# EAGLE design LIC_rack_OV-03 (EAGLE 7.2.0)
AUTHOR: M. Petrilak; VERSION: 01

## Sheet 1 of 4
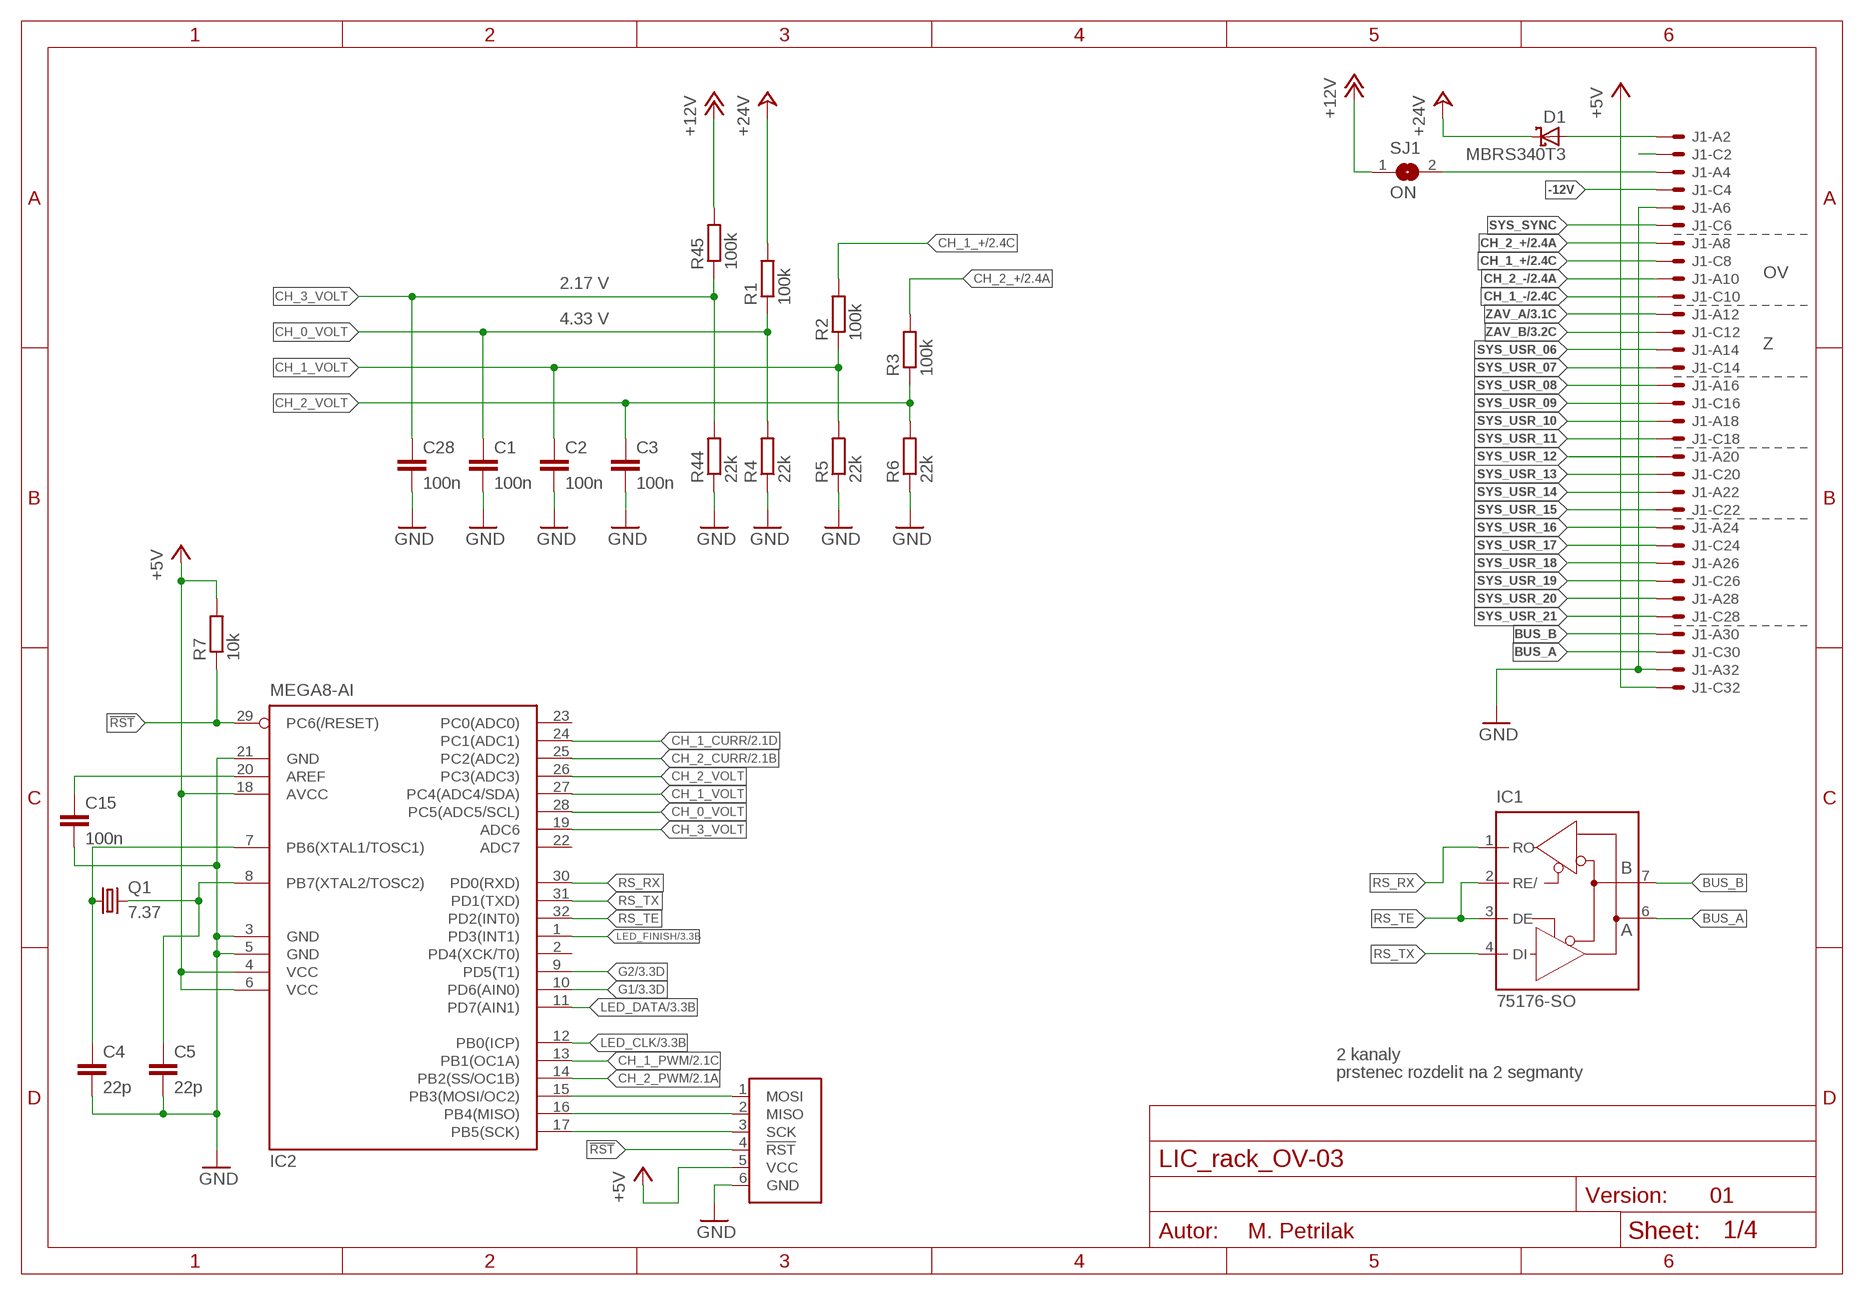
[diagram p0: schematic, sheet 1]

### Parts
C1  100n  C-EUC1206  [C1206]
C2  100n  C-EUC1206  [C1206]
C3  100n  C-EUC1206  [C1206]
C4  22p  C-EUC0805  [C0805]
C5  22p  C-EUC0805  [C0805]
C15  100n  C-EUC1206  [C1206]
C28  100n  C-EUC1206  [C1206]
D1  MBRS340T3  [SMC]
IC1  75176-SO  [SO08]
IC2  MEGA8-AI  [TQFP32-08]
J1  VG32SP  [VG32P]
Q1  7.37  XTAL  [HC49U70]
R1  100k  R-EU_R1206  [R1206]
R2  100k  R-EU_R1206  [R1206]
R3  100k  R-EU_R1206  [R1206]
R4  22k  R-EU_R1206  [R1206]
R5  22k  R-EU_R1206  [R1206]
R6  22k  R-EU_R1206  [R1206]
R7  10k  R-EU_R1206  [R1206]
R44  22k  R-EU_R1206  [R1206]
R45  100k  R-EU_R1206  [R1206]
SJ1  ON  SJ-DEFAULT  [SJ-D]
U1  ATPROG-V  [6410-06]

### Nets
!RST: IC2.29(PC6(/RESET)) R7.1 U1.4(!RST)
+5V: IC2.4(VCC) IC2.6(VCC) IC2.18(AVCC) J1.C32 R7.2 U1.5(VCC) ; also sheet 2,3
+12V: R45.2 SJ1.1 ; also sheet 3
+24V: D1.C R1.2 ; also sheet 2,3
+24V_D: D1.A J1.A2
-12V: J1.C4
AREF: C15.1 IC2.20(AREF)
BUS_A: IC1.6(A) J1.C30
BUS_B: IC1.7(B) J1.A30
CH_0_VOLT: C1.1 IC2.28(PC5(ADC5/SCL)) R1.1 R4.2
CH_1_+: J1.C8 R2.2 ; also sheet 2
CH_1_-: J1.C10 ; also sheet 2
CH_1_CURR: IC2.24(PC1(ADC1)) ; also sheet 2
CH_1_PWM: IC2.13(PB1(OC1A)) ; also sheet 2
CH_1_VOLT: C2.1 IC2.27(PC4(ADC4/SDA)) R2.1 R5.2
CH_2_+: J1.A8 R3.2 ; also sheet 2
CH_2_-: J1.A10 ; also sheet 2
CH_2_CURR: IC2.25(PC2(ADC2)) ; also sheet 2
CH_2_PWM: IC2.14(PB2(SS/OC1B)) ; also sheet 2
CH_2_VOLT: C3.1 IC2.26(PC3(ADC3)) R3.1 R6.2
CH_3_VOLT: C28.1 IC2.19(ADC6) R44.2 R45.1
G1: IC2.10(PD6(AIN0)) ; also sheet 3
G2: IC2.9(PD5(T1)) ; also sheet 3
GND: C1.2 C2.2 C3.2 C4.2 C5.2 C15.2 C28.2 IC2.3(GND) IC2.5(GND) IC2.21(GND) J1.A6 J1.A32 R4.1 R5.1 R6.1 R44.1 U1.6(GND) ; also sheet 2,3
LED_CLK: IC2.12(PB0(ICP)) ; also sheet 3
LED_DATA: IC2.11(PD7(AIN1)) ; also sheet 3
LED_FINISH: IC2.1(PD3(INT1)) ; also sheet 3
PROG_MISO: IC2.16(PB4(MISO)) U1.2(MISO)
PROG_MOSI: IC2.15(PB3(MOSI/OC2)) U1.1(MOSI)
PROG_SCK: IC2.17(PB5(SCK)) U1.3(SCK)
RS_RX: IC1.1(RO) IC2.30(PD0(RXD))
RS_TE: IC1.2(RE/) IC1.3(DE) IC2.32(PD2(INT0))
RS_TX: IC1.4(DI) IC2.31(PD1(TXD))
SYS_12V: J1.A4 SJ1.2
SYS_+5V_NC: J1.C2
SYS_SYNC: J1.C6
SYS_USR_06: J1.A14
SYS_USR_07: J1.C14
SYS_USR_08: J1.A16
SYS_USR_09: J1.C16
SYS_USR_10: J1.A18
SYS_USR_11: J1.C18
SYS_USR_12: J1.A20
SYS_USR_13: J1.C20
SYS_USR_14: J1.A22
SYS_USR_15: J1.C22
SYS_USR_16: J1.A24
SYS_USR_17: J1.C24
SYS_USR_18: J1.A26
SYS_USR_19: J1.C26
SYS_USR_20: J1.A28
SYS_USR_21: J1.C28
XTAL1: C4.1 IC2.7(PB6(XTAL1/TOSC1)) Q1.1
XTAL2: C5.1 IC2.8(PB7(XTAL2/TOSC2)) Q1.2
ZAV_A: J1.A12 ; also sheet 3
ZAV_B: J1.C12 ; also sheet 3
Unconnected: IC2.2(PD4(XCK/T0)) IC2.22(ADC7) IC2.23(PC0(ADC0))

### Notes on the sheet
- OV
- 2.17 V
- 4.33 V
- Z
- 2 kanaly
- prstenec rozdelit na 2 segmanty

## Sheet 2 of 4
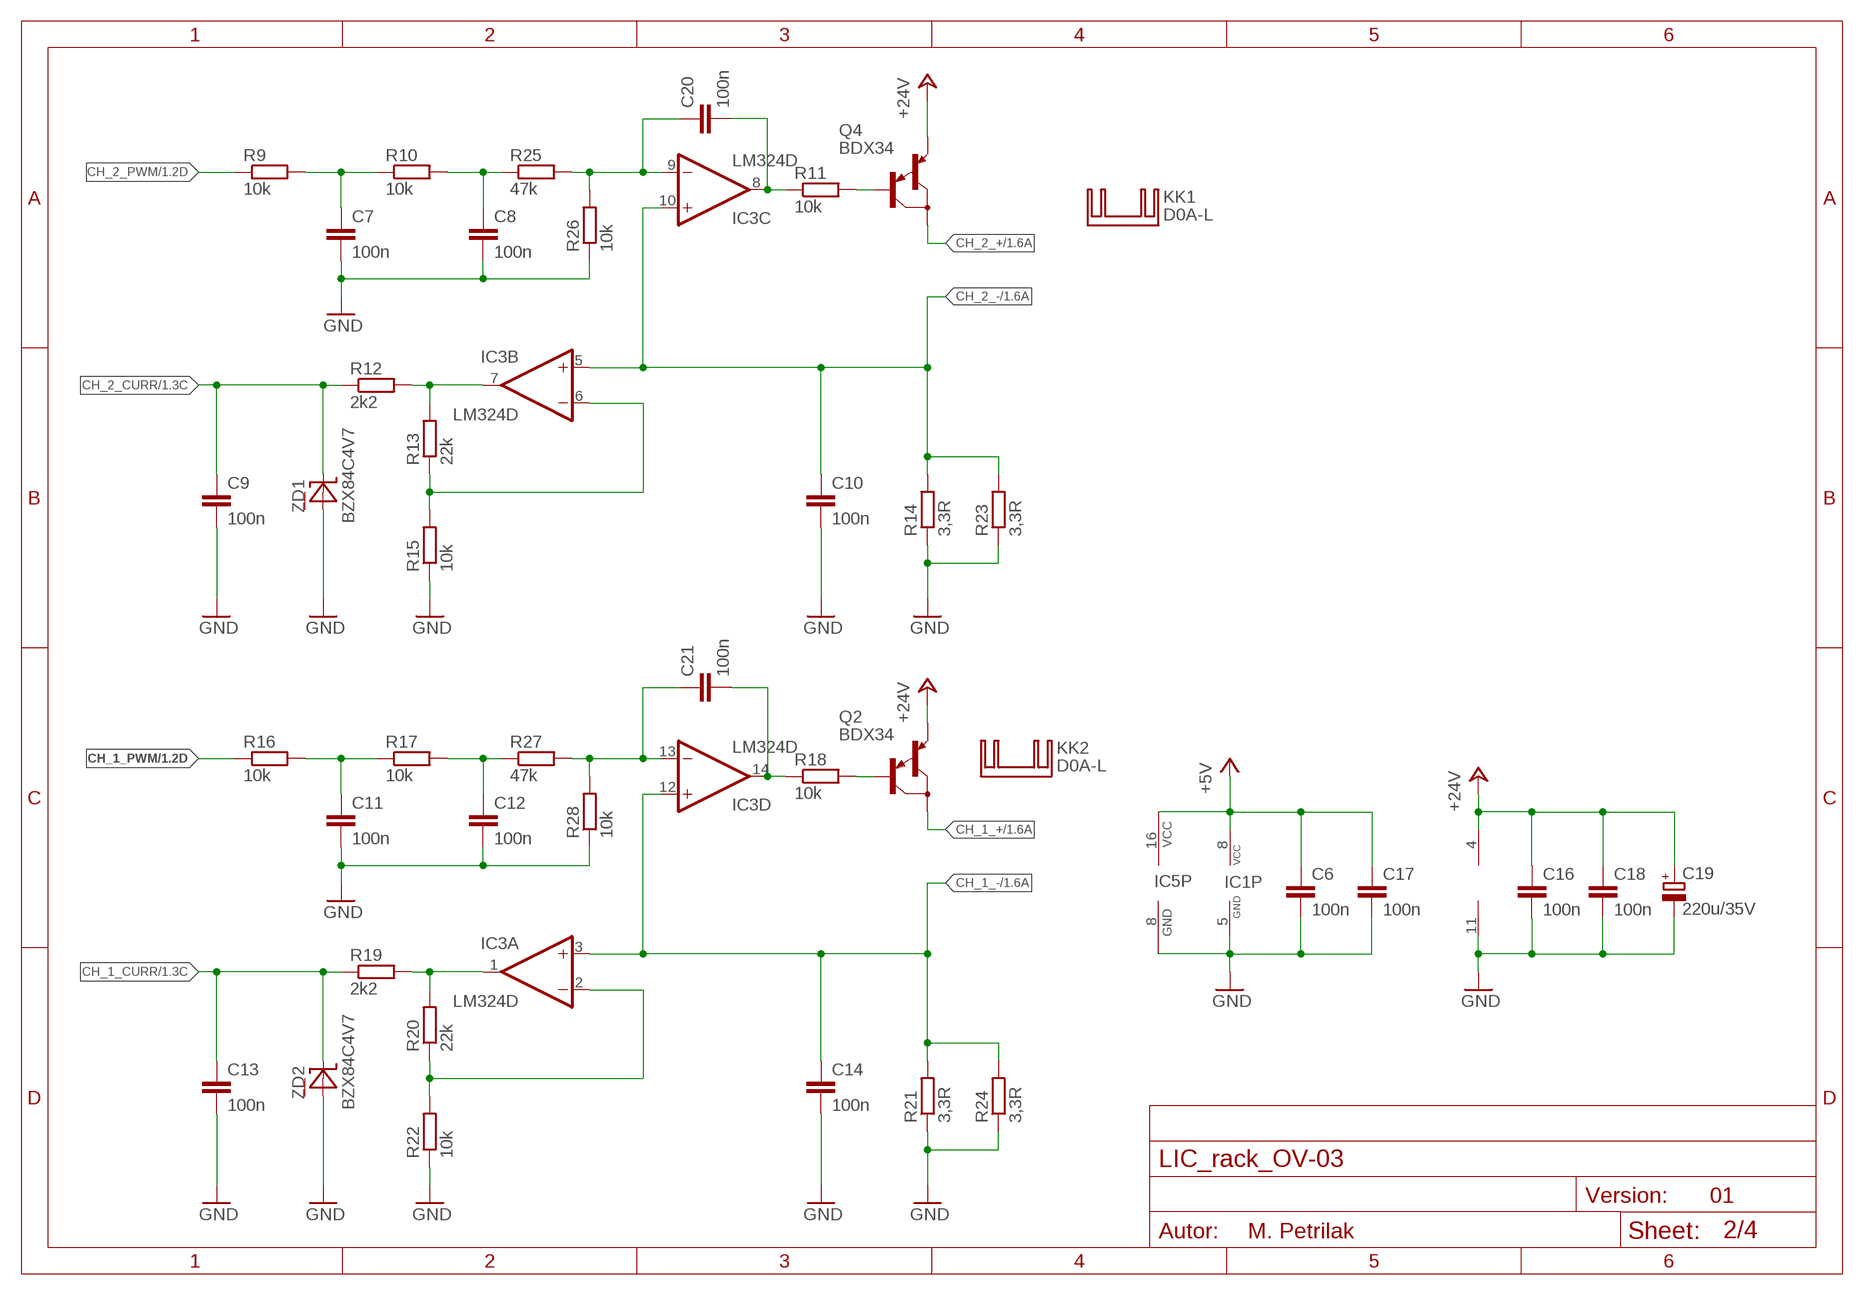
[diagram p1: schematic, sheet 2]

### Parts
C6  100n  C-EUC1206  [C1206]
C7  100n  C-EUC1206  [C1206]
C8  100n  C-EUC1206  [C1206]
C9  100n  C-EUC1206  [C1206]
C10  100n  C-EUC1206  [C1206]
C11  100n  C-EUC1206  [C1206]
C12  100n  C-EUC1206  [C1206]
C13  100n  C-EUC1206  [C1206]
C14  100n  C-EUC1206  [C1206]
C16  100n  C-EUC1206  [C1206]
C17  100n  C-EUC1206  [C1206]
C18  100n  C-EUC1206  [C1206]
C19  220u/35V  CPOL-EUE3.5-8LR  [E3,5-8LR]
C20  100n  C-EUC1206  [C1206]
C21  100n  C-EUC1206  [C1206]
IC3  LM324D  [SO14]
IC5  74LS595D  [SO16]
KK1  D0A-L  [D02A-L]
KK2  D0A-L  [D02A-L]
Q2  BDX34  [TO220]
Q4  BDX34  [TO220]
R9  10k  R-EU_R1206  [R1206]
R10  10k  R-EU_R1206  [R1206]
R11  10k  R-EU_R1206  [R1206]
R12  2k2  R-EU_R1206  [R1206]
R13  22k  R-EU_R1206  [R1206]
R14  3,3R  R-EU_0309/12  [0309/12]
R15  10k  R-EU_R1206  [R1206]
R16  10k  R-EU_R1206  [R1206]
R17  10k  R-EU_R1206  [R1206]
R18  10k  R-EU_R1206  [R1206]
R19  2k2  R-EU_R1206  [R1206]
R20  22k  R-EU_R1206  [R1206]
R21  3,3R  R-EU_0309/12  [0309/12]
R22  10k  R-EU_R1206  [R1206]
R23  3,3R  R-EU_R1206  [R1206]
R24  3,3R  R-EU_R1206  [R1206]
R25  47k  R-EU_R1206  [R1206]
R26  10k  R-EU_R1206  [R1206]
R27  47k  R-EU_R1206  [R1206]
R28  10k  R-EU_R1206  [R1206]
ZD1  BZX84C4V7  [SOT23]
ZD2  BZX84C4V7  [SOT23]

### Nets
+5V: C6.1 C17.1 IC1.8(VCC) IC5.16(VCC) ; also sheet 1,3
+24V: C16.1 C18.1 C19.+ IC3.4(P:V+) Q2.3(E) Q4.3(E) ; also sheet 1,3
CH_1_+: Q2.2(C) ; also sheet 1
CH_1_-: C14.1 IC3.3(A:+IN) IC3.12(D:+IN) R21.2 R24.2 ; also sheet 1
CH_1_BASE: Q2.1(B) R18.2
CH_1_CURR: C13.1 R19.1 ZD2.3(C) ; also sheet 1
CH_1_CURR_HIVOLT: IC3.1(A:OUT) R19.2 R20.2
CH_1_CURR_LOOP: IC3.2(A:-IN) R20.1 R22.2
CH_1_DRIVE: C21.2 IC3.14(D:OUT) R18.1
CH_1_FILT1: C11.1 R16.2 R17.1
CH_1_FILT2: C12.1 R17.2 R27.1
CH_1_FILT3: C21.1 IC3.13(D:-IN) R27.2 R28.2
CH_1_PWM: R16.1 ; also sheet 1
CH_2_+: Q4.2(C) ; also sheet 1
CH_2_-: C10.1 IC3.5(B:+IN) IC3.10(C:+IN) R14.2 R23.2 ; also sheet 1
CH_2_BASE: Q4.1(B) R11.2
CH_2_CURR: C9.1 R12.1 ZD1.3(C) ; also sheet 1
CH_2_CURR_HIVOLT: IC3.7(B:OUT) R12.2 R13.2
CH_2_CURR_LOOP: IC3.6(B:-IN) R13.1 R15.2
CH_2_DRIVE: C20.2 IC3.8(C:OUT) R11.1
CH_2_FILT1: C7.1 R9.2 R10.1
CH_2_FILT2: C8.1 R10.2 R25.1
CH_2_FILT3: C20.1 IC3.9(C:-IN) R25.2 R26.2
CH_2_PWM: R9.1 ; also sheet 1
GND: C6.2 C7.2 C8.2 C9.2 C10.2 C11.2 C12.2 C13.2 C14.2 C16.2 C17.2 C18.2 C19.- IC1.5(GND) IC3.11(P:V-) IC5.8(GND) R14.1 R15.1 R21.1 R22.1 R23.1 R24.1 R26.1 R28.1 ZD1.1(A) ZD2.1(A) ; also sheet 1,3
Unconnected: ZD1.2(NC) ZD2.2(NC)

## Sheet 3 of 4
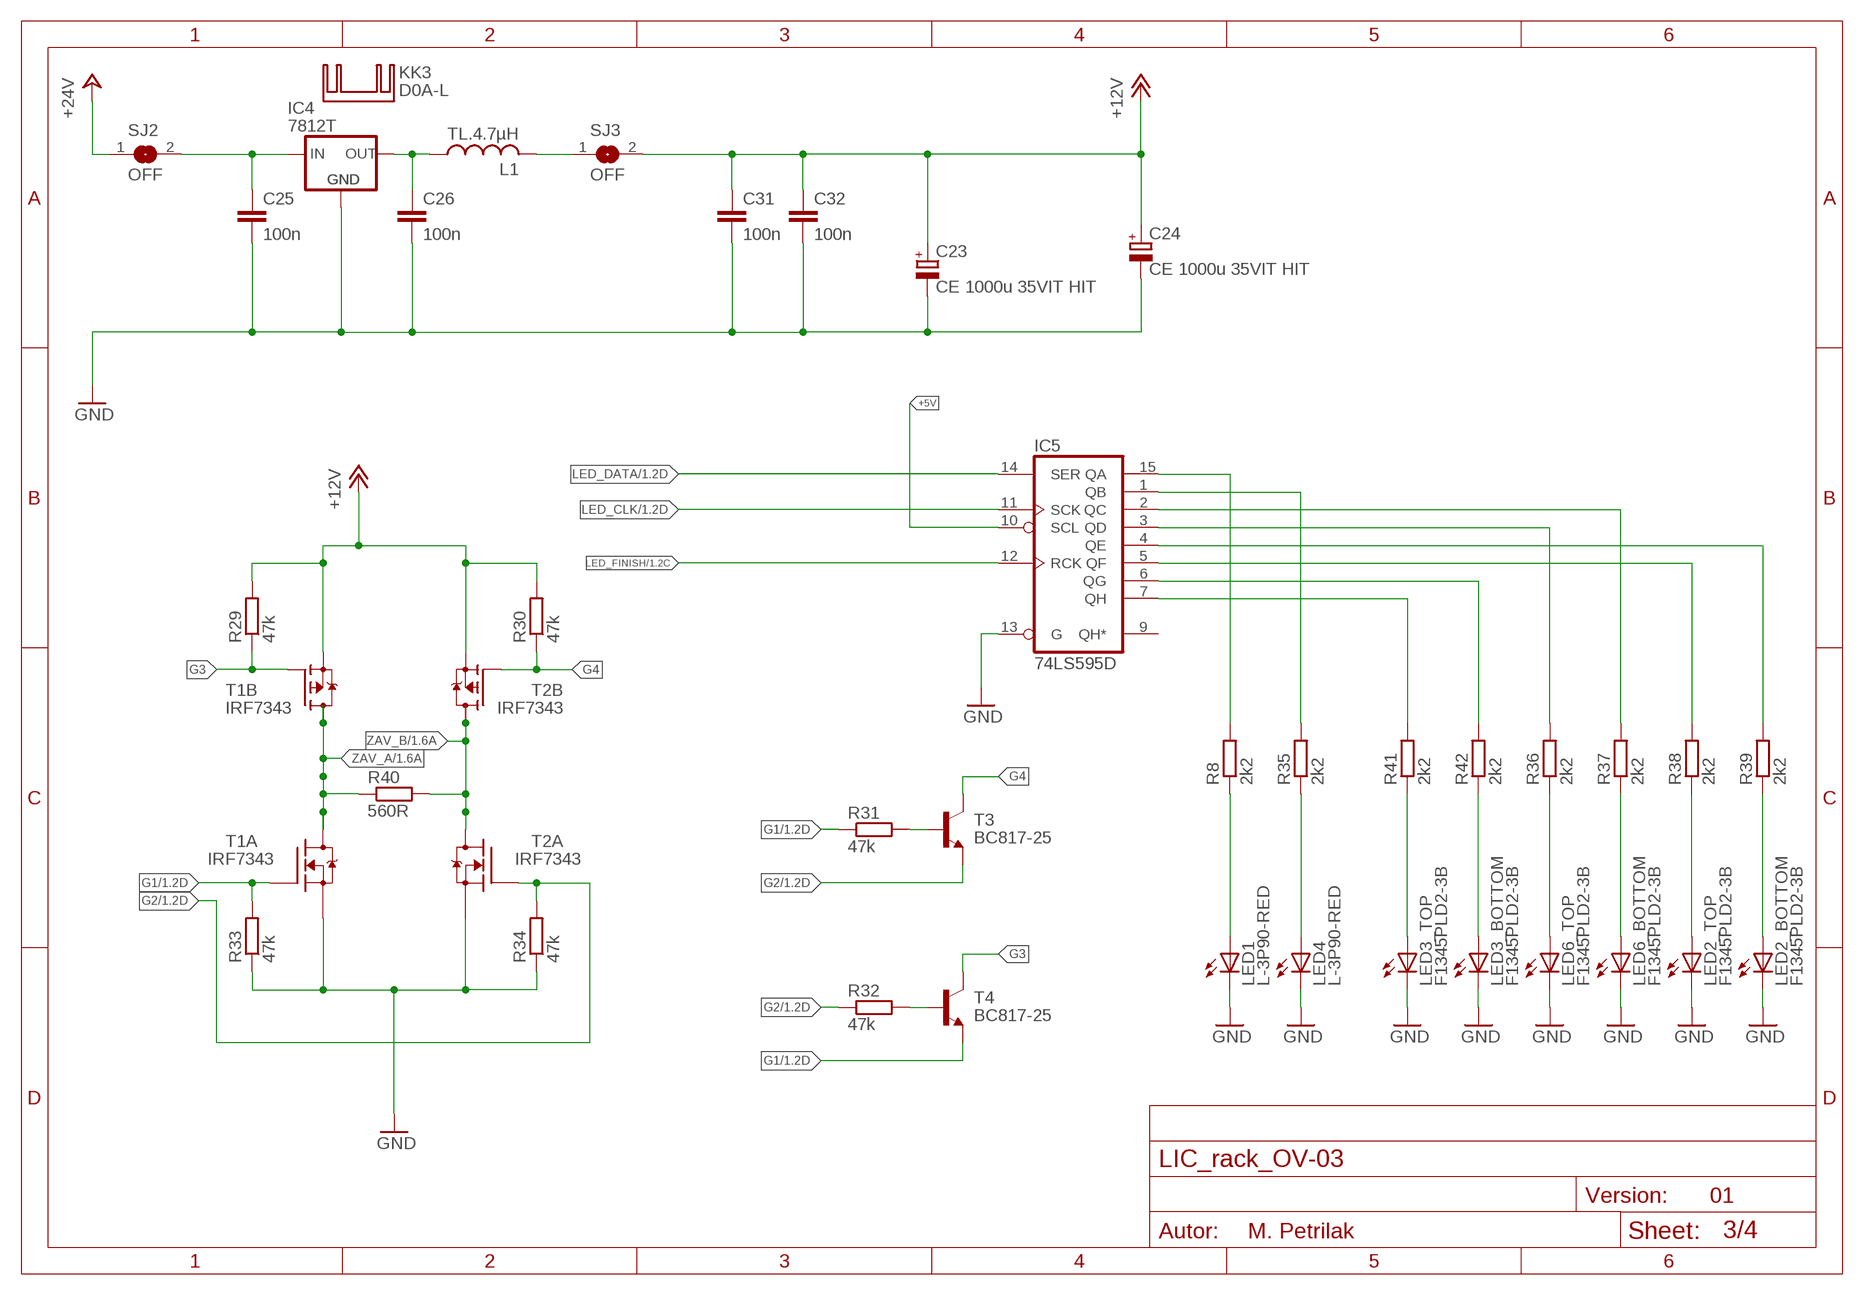
[diagram p2: schematic, sheet 3]

### Parts
C23  CE 1000u 35VIT HIT  CPOL-EUE5-13X26-LR  [E5-13X26-LR]
C24  CE 1000u 35VIT HIT  CPOL-EUE5-13X26-LR  [E5-13X26-LR]
C25  100n  C-EUC1206  [C1206]
C26  100n  C-EUC1206  [C1206]
C31  100n  C-EUC1206  [C1206]
C32  100n  C-EUC1206  [C1206]
IC4  7812T  [TO220H]
KK3  D0A-L  [D02A-L]
L1  TL.4.7µH  L-EU0207/12  [0207/12]
LED1  L-3P90-RED  [L-3P90]
LED2  F1345PLD2-3B  [F1345PLD2-3B]
LED3  F1345PLD2-3B  [F1345PLD2-3B]
LED4  L-3P90-RED  [L-3P90]
LED6  F1345PLD2-3B  [F1345PLD2-3B]
R8  2k2  R-EU_R1206  [R1206]
R29  47k  R-EU_R1206  [R1206]
R30  47k  R-EU_R1206  [R1206]
R31  47k  R-EU_R1206  [R1206]
R32  47k  R-EU_R1206  [R1206]
R33  47k  R-EU_R1206  [R1206]
R34  47k  R-EU_R1206  [R1206]
R35  2k2  R-EU_R1206  [R1206]
R36  2k2  R-EU_R1206  [R1206]
R37  2k2  R-EU_R1206  [R1206]
R38  2k2  R-EU_R1206  [R1206]
R39  2k2  R-EU_R1206  [R1206]
R40  560R  R-EU_R1206  [R1206]
R41  2k2  R-EU_R1206  [R1206]
R42  2k2  R-EU_R1206  [R1206]
SJ2  OFF  SJ  [SJ]
SJ3  OFF  SJ  [SJ]
T1  IRF7343  [SO-8]
T2  IRF7343  [SO-8]
T3  BC817-25  BC817-25-NPN-SOT23-BEC  [SOT23-BEC]
T4  BC817-25  BC817-25-NPN-SOT23-BEC  [SOT23-BEC]

### Nets
12V_FILT: L1.2 SJ3.1
12V_STAB: C26.1 IC4.3(VO) L1.1
12V_STABIN: C25.1 IC4.1(VI) SJ2.2
+5V: IC5.10(SCL) ; also sheet 1,2
+12V: C23.+ C24.+ C31.1 C32.1 R29.2 R30.2 SJ3.2 T1.3(B:S) T2.3(B:S) ; also sheet 1
+24V: SJ2.1 ; also sheet 1,2
G1: R31.1 R33.2 T1.2(A:G) T4.E ; also sheet 1
G1_B: R31.2 T3.B
G2: R32.1 R34.2 T2.2(A:G) T3.E ; also sheet 1
G2_B: R32.2 T4.B
G3: R29.1 T1.4(B:G) T4.C
G4: R30.1 T2.4(B:G) T3.C
GND: C23.- C24.- C25.2 C26.2 C31.2 C32.2 IC4.2(GND) IC5.13(G) LED1.K(C) LED2.1K(C) LED2.2K(C) LED3.1K(C) LED3.2K(C) LED4.K(C) LED6.1K(C) LED6.2K(C) R33.1 R34.1 T1.1(A:S) T2.1(A:S) ; also sheet 1,2
LED_ACT: IC5.1(QB) R35.2
LED_ACT_R: LED4.A R35.1
LED_CLK: IC5.11(SCK) ; also sheet 1
LED_DATA: IC5.14(SER) ; also sheet 1
LED_FINISH: IC5.12(RCK) ; also sheet 1
LED_OK: IC5.15(QA) R8.2
LED_OK_R: LED1.A R8.1
LED_OSV1_GREEN: IC5.7(QH) R41.2
LED_OSV1_GREEN_R: LED3.2A(A) R41.1
LED_OSV1_RED: IC5.6(QG) R42.2
LED_OSV1_RED_R: LED3.1A(A) R42.1
LED_OSV2_GREEN: IC5.3(QD) R36.2
LED_OSV2_GREEN_R: LED6.2A(A) R36.1
LED_OSV2_RED: IC5.2(QC) R37.2
LED_OSV2_RED_R: LED6.1A(A) R37.1
LED_ZAV_GREEN: IC5.5(QF) R38.2
LED_ZAV_GREEN_R: LED2.2A(A) R38.1
LED_ZAV_RED: IC5.4(QE) R39.2
LED_ZAV_RED_R: LED2.1A(A) R39.1
ZAV_A: R40.1 T1.5(B:D) T1.6(B:D1) T1.7(A:D) T1.8(A:D1) ; also sheet 1
ZAV_B: R40.2 T2.5(B:D) T2.6(B:D1) T2.7(A:D) T2.8(A:D1) ; also sheet 1
Unconnected: IC5.9(QH*)

## Sheet 4 of 4

## Library data of the parts
C1-C18 C20 C21 C25 C26 C28 C31 C32 = rcl:C-EU: CAPACITOR, European symbol
C19 C23 C24 = rcl:CPOL-EU: POLARIZED CAPACITOR, European symbol
D1 = diode:MBRS340T3
IC1 = maxim:75176
IC2 = atmel:MEGA8: MICROCONTROLLER 8 Kbytes FLASH, 1 kbytes SRAM, 512 bytes EEPROM, USART, 6-channel 10 bit ADC, 2-channel 8 bit ADC Pin compatible with Atmega48, ATMega88, ATMega168 Source: avr.lbr
IC3 = linear:LM324: OP AMP
IC4 = linear:78*: Positive VOLTAGE REGULATOR Source: http://cache.national.com/ds/LM/LM78L05.pdf http://www.fairchildsemi.com/ds/LM/LM7805.pdf
IC5 = 74xx-us:74*595: 8-bit SHIFT REGISTER, output latch
J1 = 19inch:VG32S: PCB EUROCARD, 32-pin type C/AC, 5.08 mm
KK1-KK3 = heatsink:D0A-L: HEATSINK distributor Schukat
L1 = rcl:L-EU: INDUCTOR, European symbol
LED1 LED4 = led:L-3P90
LED2 LED3 LED6 = led:F1345PLD2-3B
Q1 = crystal:XTAL
Q2 Q4 = transistor-pnp:BDX34: PNP Darlington Transistor
R1-R42 R44 R45 = rcl:R-EU_: RESISTOR, European symbol
SJ1-SJ3 = jumper:SJ: SMD solder JUMPER
T1 T2 = transistor-fet:IRF7343
T3 T4 = transistor:*-NPN-: NPN Transistror BF959 corrected 2008.03.06
U1 = con-molex:ATPROG
ZD1 ZD2 = diode:BZX84C*

## Net classes
1 PC: clearance 2 mm to class 0

## Board
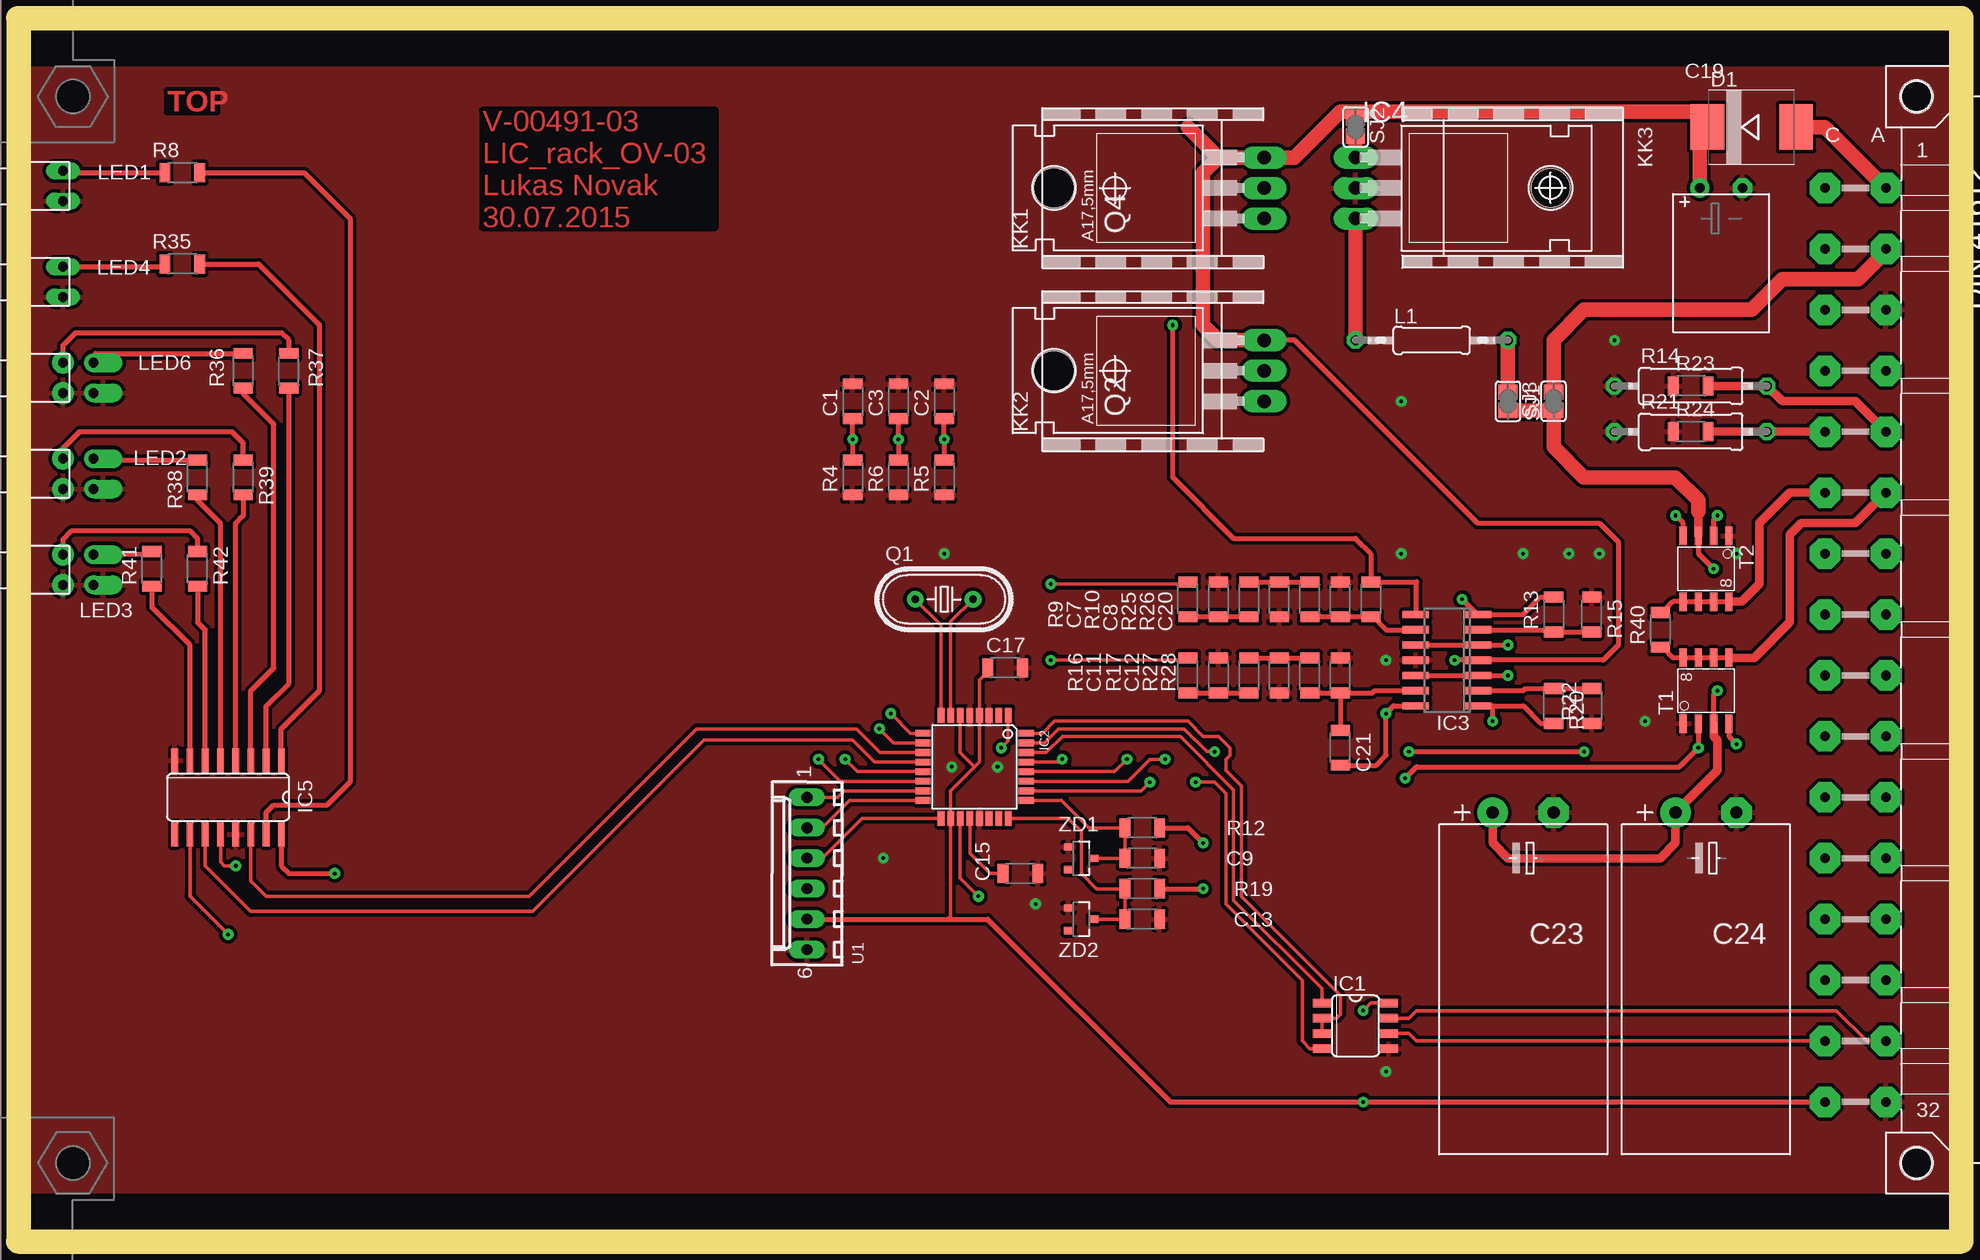
[diagram p3: board, top side]
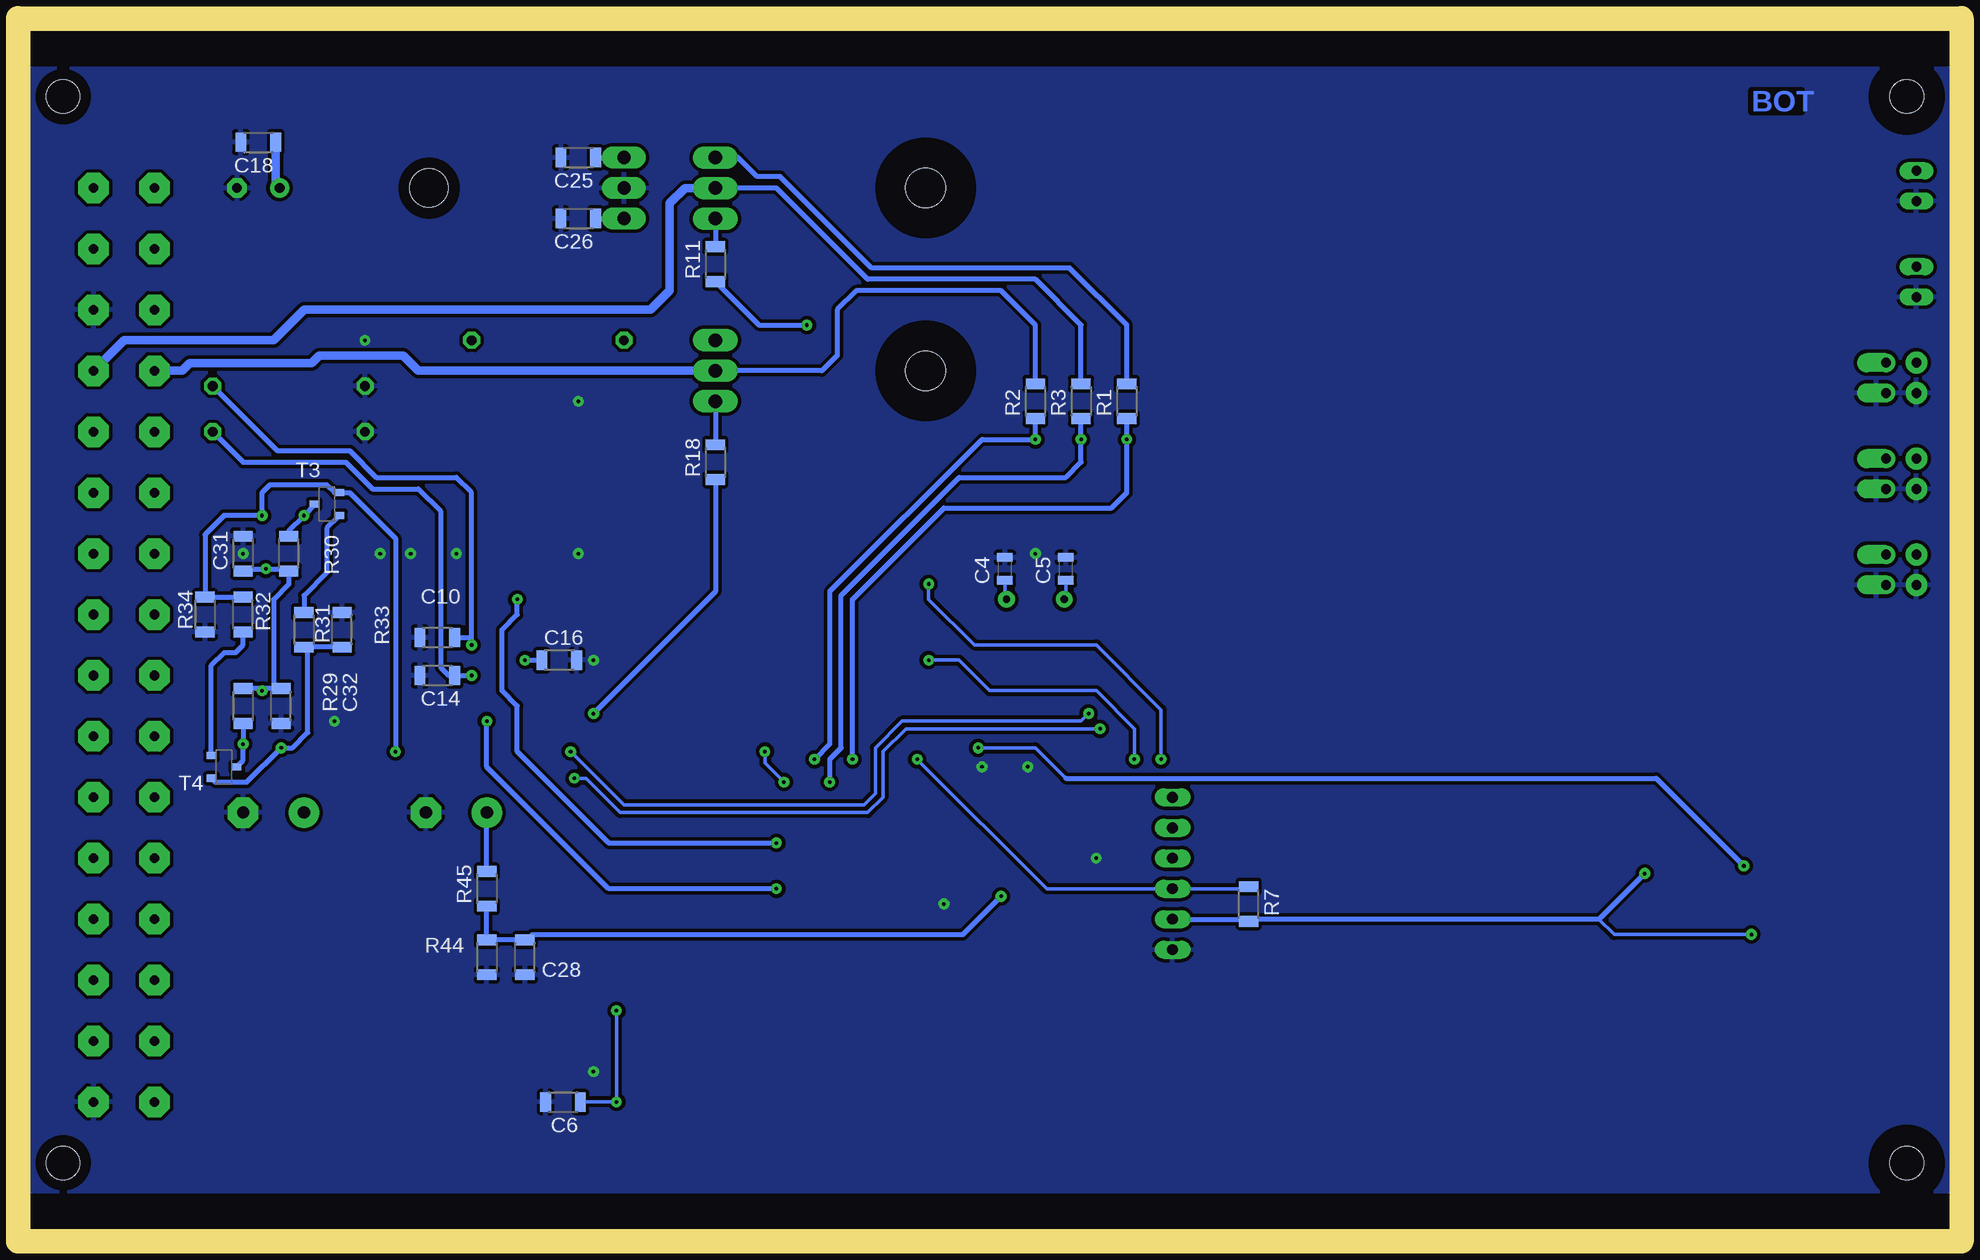
[diagram p4: board, bottom side, seen from below]

Size 160 x 100 mm. Coordinates in mm from the lower left corner, seen from the top.
Copper layers (1*16): Top 0.04mm / dielectric 1.5mm / Bottom 0.04mm
Design rules "mucha_navrh": minimum track width 0.2mm, minimum drill 0.3mm, track to track 0.3mm, track to pad 0.3mm, pad to pad 0.3mm, via to via 0.3mm, smd to smd 0mil, copper to edge 0.01mm, drill to drill 0.3mm, minimum pad ring 0.3mm, minimum via ring 0.3mm, stop-mask expansion 0.1mm, vias tented up to drill 0.5mm, thermal gap 0.3mm

### Footprints (pad centres in the part's own frame; a part is rotated, then mirrored left to right if it is on the bottom)
C1206 = smd 0.9 x 1.6: 1 -1.45,0; 2 1.45,0
C0805 = smd 0.7 x 1.3: 1 -0.95,0; 2 0.95,0
E3,5-8LR = drill 0.813 pad 1.6: + -1.778,0 | drill 0.813 pad 1.6 octagon: - 1.778,0
E5-13X26-LR = drill 1.016 pad 2.54: + -2.54,0 | drill 1.016 pad 2.54 octagon: - 2.54,0
SMC = smd 2.8 x 3.8: A 3.7,0; C -3.7,0
SO08 = smd 0.72 x 1.5: 1 -1.905,-2.8; 2 -0.635,-2.8; 3 0.635,-2.8; 4 1.905,-2.8; 5 1.905,2.8; 6 0.635,2.8; 7 -0.635,2.8; 8 -1.905,2.8
TQFP32-08 = smd 1.27 x 0.559: 1 -4.293,2.8; 2 -4.293,2; 3 -4.293,1.2; 4 -4.293,0.4; 5 -4.293,-0.4; 6 -4.293,-1.2; 7 -4.293,-2; 8 -4.293,-2.8; 17 4.293,-2.8; 18 4.293,-2; 19 4.293,-1.2; 20 4.293,-0.4; 21 4.293,0.4; 22 4.293,1.2; 23 4.293,2; 24 4.293,2.8 | smd 0.559 x 1.27: 9 -2.8,-4.293; 10 -2,-4.293; 11 -1.2,-4.293; 12 -0.4,-4.293; 13 0.4,-4.293; 14 1.2,-4.293; 15 2,-4.293; 16 2.8,-4.293; 25 2.8,4.293; 26 2,4.293; 27 1.2,4.293; 28 0.4,4.293; 29 -0.4,4.293; 30 -1.2,4.293; 31 -2,4.293; 32 -2.8,4.293
SO14 = smd 0.6 x 2.2: 1 -3.81,-2.6; 2 -2.54,-2.6; 3 -1.27,-2.6; 4 0,-2.6; 5 1.27,-2.6; 6 2.54,-2.6; 7 3.81,-2.6; 8 3.81,2.6; 9 2.54,2.6; 10 1.27,2.6; 11 0,2.6; 12 -1.27,2.6; 13 -2.54,2.6; 14 -3.81,2.6
TO220H = drill 1.1 pad 1.7 long: 1 -2.54,-10.16; 2 0,-10.16; 3 2.54,-10.16 | hole 3.2: 0,6.096
SO16 = smd 0.55 x 2: 1 -4.445,-3.073; 2 -3.175,-3.073; 3 -1.905,-3.073; 4 -0.635,-3.073; 5 0.635,-3.073; 6 1.905,-3.073; 7 3.175,-3.073; 8 4.445,-3.073; 9 4.445,3.073; 10 3.175,3.073; 11 1.905,3.073; 12 0.635,3.073; 13 -0.635,3.073; 14 -1.905,3.073; 15 -3.175,3.073; 16 -4.445,3.073
VG32P = drill 0.8 pad 2.54 octagon: A2 154.7,36.83; A4 154.7,31.75; A6 154.7,26.67; A8 154.7,21.59; A10 154.7,16.51; A12 154.7,11.43; A14 154.7,6.35; A16 154.7,1.27; A18 154.7,-3.81; A20 154.7,-8.89; A22 154.7,-13.97; A24 154.7,-19.05; A26 154.7,-24.13; A28 154.7,-29.21; A30 154.7,-34.29; A32 154.7,-39.37; C2 149.62,36.83; C4 149.62,31.75; C6 149.62,26.67; C8 149.62,21.59; C10 149.62,16.51; C12 149.62,11.43; C14 149.62,6.35; C16 149.62,1.27; C18 149.62,-3.81; C20 149.62,-8.89; C22 149.62,-13.97; C24 149.62,-19.05; C26 149.62,-24.13; C28 149.62,-29.21; C30 149.62,-34.29; C32 149.62,-39.37 | hole 2.794: 3.57,44.45; 3.57,-44.45; 157.24,44.45; 157.24,-44.45; 3.57,44.45; 3.57,-44.45; 157.24,44.45; 157.24,-44.45
0207/12 = drill 0.813 octagon: 1 -6.35,0; 2 6.35,0
L-3P90 = drill 0.813 long: A 4.7,1.27; K 4.7,-1.27
F1345PLD2-3B = drill 0.8 pad 1.8: 1A 4.7,1.27; 1K 4.7,-1.27 | drill 0.8 pad 1.6 offset: 2A 7.24,1.27; 2K 7.24,-1.27
HC49U70 = drill 0.6 pad 1.4: 1 -2.413,0; 2 2.413,0
TO220 = drill 1.118 long: 1 -2.54,-6.35; 2 0,-6.35; 3 2.54,-6.35 | hole 3.302: 0,11.176
R1206 = smd 0.9 x 1.6: 1 -1.45,0; 2 1.45,0
0309/12 = drill 0.813 octagon: 1 -6.35,0; 2 6.35,0
SJ-D = smd 1.27 x 1.6: 1 -0.762,0; 2 0.762,0
SJ = smd 1.27 x 1.6: 1 -0.762,0; 2 0.762,0
SO-8 = smd 1.524 x 0.61: 1 -2.743,1.905; 2 -2.743,0.635; 3 -2.743,-0.635; 4 -2.743,-1.905; 5 2.743,-1.905; 6 2.743,-0.635; 7 2.743,0.635; 8 2.743,1.905
SOT23-BEC = smd 0.6 x 0.8: B -0.95,-1.05; C 0,1.05; E 0.95,-1.05
6410-06 = drill 0.9 long: 1 6.35,0; 2 3.81,0; 3 1.27,0; 4 -1.27,0; 5 -3.81,0; 6 -6.35,0
SOT23 = smd 0.6 x 0.8: 1 -0.95,-1.05; 2 0.95,-1.05; 3 0,1.05

### Placement (x,y rotation side)
C1  68.58,69.05 90 top
C2  76.2,69.05 90 top
C3  72.39,69.05 90 top
C4  78.74,55.08 90 bottom
C5  73.66,55.08 90 bottom
C6  115.57,10.63 180 bottom
C7  99.06,52.54 90 top
C8  104.14,52.54 270 top
C9  92.71,30.95 0 top
C10  126.05,49.37 180 bottom
C11  99.06,46.19 90 top
C12  104.14,46.19 270 top
C13  92.71,25.87 0 top
C14  126.05,46.19 180 bottom
C15  82.55,29.68 0 top
C16  115.89,47.46 0 bottom
C17  81.28,46.83 0 top
C18  140.97,90.64 180 bottom
C19  140.97,86.83 0 top
C20  111.76,52.54 90 top
C21  109.22,40.16 270 top
C23  124.46,34.76 0 top
C24  139.7,34.76 0 top
C25  114.3,89.37 180 bottom
C26  114.3,84.29 180 bottom
C28  118.75,22.7 270 bottom
C31  142.24,56.35 90 bottom
C32  139.06,43.65 270 bottom
D1  143.51,91.91 0 top
IC1  110.49,16.98 270 top
IC2  78.74,38.57 270 top
IC3  118.11,47.46 90 top
IC4  120.65,86.83 270 top
IC5  16.51,36.03 180 top
J1  0,50 0 top
KK1  96.52,86.83 0 top
KK2  96.52,71.59 0 top
KK3  120.65,86.83 180 top
L1  116.84,74.13 0 top
LED1  -1.94,87 0 top
LED2  -1.94,63 0 top
LED3  -1.94,55 0 top
LED4  -1.94,79 0 top
LED6  -1.94,71 0 top
Q1  76.2,52.54 180 top
Q2  96.52,71.59 90 top
Q4  96.52,86.83 90 top
R1  68.58,69.05 90 bottom
R2  76.2,69.05 90 bottom
R3  72.39,69.05 90 bottom
R4  68.58,62.7 90 top
R5  76.2,62.7 90 top
R6  72.39,62.7 90 top
R7  58.42,27.14 270 bottom
R8  12.7,88.1 0 top
R9  96.52,52.54 270 top
R10  101.6,52.54 90 top
R11  102.87,80.48 90 bottom
R12  92.71,33.49 0 top
R13  127,51.27 90 top
R14  138.43,70.32 0 top
R15  130.18,51.27 270 top
R16  96.52,46.19 270 top
R17  101.6,46.19 90 top
R18  102.87,63.97 90 bottom
R19  92.71,28.41 0 top
R20  127,43.65 270 top
R21  138.43,66.51 0 top
R22  130.18,43.65 90 top
R23  138.43,70.32 0 top
R24  138.43,66.51 0 top
R25  106.68,52.54 270 top
R26  109.22,52.54 270 top
R27  106.68,46.19 270 top
R28  109.22,46.19 270 top
R29  142.24,43.65 90 bottom
R30  138.43,56.35 270 bottom
R31  137.16,50 90 bottom
R32  142.24,51.27 270 bottom
R33  133.99,50 270 bottom
R34  145.41,51.27 90 bottom
R35  12.7,80.48 0 top
R36  17.78,71.59 270 top
R37  21.59,71.59 270 top
R38  13.97,62.7 270 top
R39  17.78,62.7 270 top
R40  135.89,50 90 top
R41  10.16,55.08 270 top
R42  13.97,55.08 270 top
R44  121.92,22.7 90 bottom
R45  121.92,28.41 90 bottom
SJ1  127,69.05 90 top
SJ2  110.49,91.91 270 top
SJ3  123.19,69.05 270 top
T1  139.7,44.92 90 top
T2  139.7,55.08 270 top
T3  135.25,60.48 90 bottom
T4  143.83,38.57 270 bottom
U1  64.77,29.68 90 top
ZD1  87.63,30.95 270 top
ZD2  87.63,25.87 270 top

### Tracks (layer width: path | path; a pad name or v marks a point on that pad's centre or on a via)
12V_FILT
  Top 1.2: SJ3.1 L1.2
12V_STAB
  Top 1.2: IC4.3 L1.1
  Bottom 0.406: C26.1 IC4.3
12V_STABIN
  Top 1.2: IC4.1 SJ2.2
  Bottom 0.406: C25.1 IC4.1
!RST  (via drill 0.3)
  Top 0.305: IC2.29 85.81,38.97 v86.04,39.2
  Bottom 0.305: R7.1 58.6,28.41 U1.4 75.25,28.41 v86.04,39.2
+5V  (via drill 0.3)
  Top 0.305: IC2.6 77.54,39.77 78.74,38.57 | 78.74,38.57 79.14,38.97 IC2.4 79.14,45.82 79.83,46.51 C17.1 | 78.74,38.57 76.74,36.57 IC2.18 76.74,26.09 76.52,25.87 | IC1.8 111.76,18.89 v111.12,18.25 | IC5.10 13.34,27.77 v16.51,24.6
  Top 0.406: J1.C32 v111.12,10.63 95.06,10.63 79.82,25.87 76.52,25.87 U1.5 | IC5.16 20.95,30.32 21.59,29.68 v25.4,29.68
  Bottom 0.305: v111.12,18.25 v111.12,10.63 C6.1 | v16.51,24.6 27.94,24.6 29.21,25.87
  Bottom 0.406: v25.4,29.68 29.21,25.87 58.42,25.87 | 58.42,25.87 R7.2 | U1.5 58.42,25.87
+12V  (via drill 0.3)
  Top 0.406: T2.3 139.06,56.35 v140.34,55.08 | T1.3 140.34,44.6 v140.65,44.92
  Top 0.7: C23.+ 121.92,32.22 123.19,30.95 135.89,30.95 137.16,32.22 C24.+ 140.65,38.25 140.65,40.79 140.34,41.11 T1.3 | 139.06,59.84 T2.3
  Top 1.2: SJ3.2 SJ1.1 127,65.24 129.54,62.7 137.16,62.7 139.06,60.8 139.06,59.84
  Bottom 0.406: C31.1 142.06,55.08 v140.34,55.08 138.61,55.08 R30.2 138.43,53.81 139.7,52.54 139.7,45.1 | v140.65,44.92 140.65,45.1 | C32.1 139.7,45.1 | 139.7,45.1 140.65,45.1 | 140.65,45.1 R29.2 | R45.2 C23.+
+24V  (via drill 0.3)
  Top 0.406: v118.75,47.46 IC3.4 131.13,47.46 132.4,48.73 132.4,57.3 130.81,58.89 120.65,58.89 105.41,74.13 Q2.3 | SJ2.1 110.49,93.18 | 139.7,91.8 D1.C
  Top 1.2: 99.06,89.37 Q4.3 105.41,89.37 109.22,93.18 110.49,93.18 139.81,93.18 D1.C | 99.06,89.37 97.79,88.1 97.79,75.4 99.06,74.13 Q2.3 | 96.52,91.91 99.06,89.37 | 139.7,91.8 139.19,91.29 C19.+
  Bottom 0.406: v118.75,47.46 C16.1 | R1.2 68.58,75.4 73.34,80.16 89.85,80.16 97.47,87.78 99.38,87.78 100.97,89.37 Q4.3
  Bottom 0.7: C18.1 139.52,87.16 C19.+
+24V_D
  Top 1.2: D1.A 149.62,91.91 J1.A2
AREF
  Top 0.305: C15.1 80.01,29.68 78.34,31.35 IC2.20
BUS_A
  Top 0.305: IC1.6 114.94,16.34 115.57,15.71 J1.C30
BUS_B
  Top 0.305: J1.A30 153.11,15.71 150.57,18.25 115.57,18.25 114.94,17.62 IC1.7
CH_0_VOLT  (via drill 0.3)
  Top 0.305: IC2.28 90.41,38.17 v91.44,39.2
  Top 0.406: C1.1 v68.58,65.88 R4.2
  Bottom 0.406: C1.1 v68.58,65.88 68.58,61.43 69.85,60.16 83.82,60.16 91.44,52.54 v91.44,39.2
CH_1_+
  Bottom 0.406: Q2.2 93.98,71.59 92.71,72.86 92.71,76.67 91.12,78.26 79.06,78.26 76.2,75.4 R2.2
  Bottom 0.7: J1.C8 147.32,71.59 146.69,72.22 136.53,72.22 135.89,72.86 128.91,72.86 127.64,71.59 Q2.2
CH_1_-  (via drill 0.3)
  Top 0.406: IC3.12 IC3.3 v123.19,46.19
  Top 0.7: R24.2 R21.2 J1.C10
  Bottom 0.406: v123.19,46.19 C14.1 125.09,46.19 125.73,46.83 125.73,59.84 127.64,61.75 131.44,61.75 133.67,63.97 142.24,63.97 R21.2
CH_1_BASE
  Bottom 0.406: Q2.1 R18.2
CH_1_CURR
  Top 0.305: ZD2.3 C13.1 R19.1 88.9,28.41 87.63,29.68 87.63,33.17 86.53,34.28 IC2.24
CH_1_CURR_HIVOLT  (via drill 0.3)
  Top 0.406: 121.92,43.65 IC3.1 | 121.92,43.65 124.46,43.65 125.91,42.2 R20.2 | v121.92,42.38 121.92,43.65 | R19.2 v97.79,28.41
  Bottom 0.406: v97.79,28.41 111.76,28.41 121.92,38.57 v121.92,42.38
CH_1_CURR_LOOP
  Top 0.406: IC3.2 124.46,44.92 124.64,45.1 R20.1 R22.2
CH_1_DRIVE  (via drill 0.3)
  Top 0.406: IC3.14 113.67,43.65 v113.03,43.02 113.03,39.52 112.22,38.71 C21.2
  Bottom 0.406: R18.1 102.87,53.17 v113.03,43.02
CH_1_FILT1
  Top 0.406: R17.1 C11.1 R16.2
CH_1_FILT2
  Top 0.406: R27.1 C12.1 R17.2
CH_1_FILT3
  Top 0.406: R27.2 R28.2 | R28.2 111.9,44.74 112.08,44.92 IC3.13 | R28.2 C21.1
CH_1_PWM  (via drill 0.3)
  Top 0.305: R16.1 96.34,47.46 v85.09,47.46 | IC2.13 68.98,38.17 v67.94,39.2
  Bottom 0.305: v85.09,47.46 82.55,47.46 80.01,44.92 71.12,44.92 67.94,41.74 v67.94,39.2
CH_1_VOLT  (via drill 0.3)
  Top 0.305: IC2.27 91.51,37.37 93.34,39.2 v94.61,39.2
  Top 0.406: C2.1 v76.2,65.88 R5.2
  Bottom 0.406: C2.1 v76.2,65.88 80.64,65.88 93.34,53.17 93.34,40.48 v94.61,39.2
CH_2_+
  Bottom 0.406: Q4.2 97.79,86.83 90.17,79.21 76.2,79.21 72.39,75.4 R3.2
  Bottom 0.7: Q4.2 105.41,86.83 106.68,85.56 106.68,78.26 108.27,76.67 137.16,76.67 139.7,74.13 152.16,74.13 J1.A8
CH_2_-  (via drill 0.3)
  Top 0.406: IC3.10 IC3.5 v123.19,48.73
  Top 0.7: J1.A10 152.16,69.05 146.05,69.05 R14.2 R23.2
  Bottom 0.406: v123.19,48.73 123.19,49.37 | 123.19,49.37 123.19,61.43 124.46,62.7 131.13,62.7 133.35,64.92 139.38,64.92 R14.2 | C10.1 123.19,49.37
CH_2_BASE
  Bottom 0.406: Q4.1 R11.2
CH_2_CURR
  Top 0.305: ZD1.3 C9.1 R12.1 88.27,33.49 85.98,35.77 IC2.25
CH_2_CURR_HIVOLT  (via drill 0.3)
  Top 0.406: R13.2 125.91,52.72 124.46,51.27 IC3.7 120.65,51.27 v119.38,52.54 | R12.2 96.52,33.49 v97.79,32.22
  Bottom 0.406: v119.38,52.54 119.38,51.27 120.65,50 120.65,44.92 119.38,43.65 119.38,39.84 111.76,32.22 v97.79,32.22
CH_2_CURR_LOOP
  Top 0.406: IC3.6 126.82,50 R13.1 R15.2
CH_2_DRIVE  (via drill 0.3)
  Top 0.406: IC3.8 115.57,51.33 115.57,53.99 C20.2 111.76,56.35 110.49,57.62 100.33,57.62 95.25,62.7 v95.25,75.4
  Bottom 0.406: R11.1 99.24,75.4 v95.25,75.4
CH_2_FILT1
  Top 0.406: R9.2 C7.1 R10.1
CH_2_FILT2
  Top 0.406: R10.2 C8.1 R25.1
CH_2_FILT3
  Top 0.406: R25.2 R26.2 C20.1 111.94,51.09 113.03,50 IC3.9
CH_2_PWM  (via drill 0.3)
  Top 0.305: R9.1 96.34,53.81 v85.09,53.81 | IC2.14 67.56,37.37 v65.72,39.2
  Bottom 0.305: v85.09,53.81 85.09,52.54 81.28,48.73 71.12,48.73 65.72,43.33 v65.72,39.2
CH_2_VOLT  (via drill 0.3)
  Top 0.305: IC2.26 92.61,36.57 v93.34,37.3
  Top 0.406: C3.1 v72.39,65.88 R6.2
  Bottom 0.406: C3.1 v72.39,65.88 72.39,63.97 73.66,62.7 82.55,62.7 92.39,52.86 92.39,40.16 93.34,39.2 v93.34,37.3
CH_3_VOLT  (via drill 0.3)
  Top 0.305: IC2.19 77.54,29.29 v79.06,27.77
  Bottom 0.406: R45.1 R44.2 C28.1 118.56,24.14 118.11,24.6 82.23,24.6 v79.06,27.77
G1  (via drill 0.3)
  Top 0.305: IC2.10 71.98,40.57 v70.8,41.74
  Top 0.406: T1.2 v139.06,40.16 137.48,38.57 115.57,38.57 v114.62,37.62
  Bottom 0.305: v70.8,41.74 87,41.74 88.9,39.84 88.9,36.03 90.17,34.76 110.81,34.76 113.67,37.62 v114.62,37.62
  Bottom 0.406: R33.2 R31.1 136.84,48.23 136.84,41.43 138.11,40.16 v139.06,40.16 141.92,37.3 144.56,37.3 T4.E
G1_B
  Bottom 0.406: R31.2 137.16,52.86 135.25,54.76 135.25,58.48 T3.B
G2  (via drill 0.3)
  Top 0.305: IC2.9 73.4,41.37 v71.75,43.02
  Top 0.406: T2.2 140.34,59.21 v140.65,59.52 | v114.94,39.84 v129.54,39.84
  Bottom 0.305: v71.75,43.02 72.39,42.38 87.31,42.38 89.53,40.16 89.53,36.35 90.49,35.39 110.49,35.39 v114.94,39.84
  Bottom 0.406: R32.1 R34.2 145.41,57.94 143.83,59.52 v140.65,59.52 140.65,61.43 140.02,62.06 135.25,62.06 134.62,61.43 T3.E 133.35,61.43 129.54,57.62 v129.54,39.84
G2_B
  Bottom 0.406: R32.2 142.24,48.73 142.88,48.09 143.83,48.09 144.88,47.05 T4.B
G3  (via drill 0.3)
  Top 0.406: T1.4 141.6,41.11 v142.24,40.48
  Bottom 0.406: R29.1 v142.24,40.48 142.24,39.11 T4.C
G4  (via drill 0.3)
  Top 0.406: T2.4 137.79,58.89 v137.16,59.52
  Bottom 0.406: 136.98,59.34 v137.16,59.52 | R30.1 138.43,58.26 v137.16,59.52 | T3.C 136.31,60.38 v137.16,59.52
GND  (via drill 0.3)
  other vias: 80.64,38.57 76.83,38.57 71.12,30.95 113.03,47.46 113.03,13.17 76.2,56.35 134.62,42.38 142.24,56.35 132.08,74.13 114.3,56.35 124.46,56.35 128.27,56.35 114.3,69.05 83.82,27.14 130.81,56.35
  pour Bottom: 0,0.47 160.02,0.47 160.02,99.53 0,99.53
  pour Top: 0,0.47 160.02,0.47 160.02,99.53 0,99.53
LED_ACT
  Top 0.406: R35.2 19.05,80.48 24.13,75.4 24.13,44.92 20.95,41.74 IC5.1
LED_ACT_R
  Top 0.406: LED4.A 11.04,80.27 R35.1
LED_CLK
  Top 0.305: IC2.12 70.4,38.97 68.58,40.79 56.2,40.79 41.91,26.5 18.41,26.5 14.61,30.32 IC5.11
LED_DATA
  Top 0.305: IC2.11 70.87,39.77 68.9,41.74 55.56,41.74 41.59,27.77 19.68,27.77 18.41,29.05 IC5.14
LED_FINISH  (via drill 0.3)
  Top 0.305: IC2.1 81.54,40.73 v80.96,40.16 | v17.14,30.32 16.19,30.32 15.88,30.63 IC5.12
  Bottom 0.305: v80.96,40.16 76.2,40.16 73.66,37.62
  Bottom 0.406: 73.66,37.62 24.45,37.62 v17.14,30.32
LED_OK
  Top 0.406: IC5.15 19.68,34.76 20.32,35.39 24.77,35.39 26.67,37.3 26.67,84.29 22.86,88.1 R8.2
LED_OK_R
  Top 0.406: LED1.A 2.33,88.1 R8.1
LED_OSV1_GREEN
  Top 0.406: IC5.7 13.34,48.72 10.16,51.89 R41.2
LED_OSV1_GREEN_R
  Top 0.406: R41.1 9.9,56.27 LED3.2A
LED_OSV1_RED
  Top 0.406: R42.2 13.97,50.62 14.61,49.98 IC5.6
LED_OSV1_RED_R
  Top 0.406: R42.1 13.97,57.62 13.34,58.26 3.49,58.26 2.76,57.52 LED3.1A
LED_OSV2_GREEN
  Top 0.406: R36.2 17.78,69.67 20.32,67.13 20.32,46.81 18.41,44.91 IC5.3
LED_OSV2_GREEN_R
  Top 0.406: LED6.2A 5.47,73.04 R36.1
LED_OSV2_RED
  Top 0.406: IC5.2 19.68,43.63 21.59,45.54 R37.2
LED_OSV2_RED_R
  Top 0.406: R37.1 21.59,74.13 20.95,74.77 3.81,74.77 2.76,73.72 LED6.1A
LED_ZAV_GREEN
  Top 0.406: R38.2 13.97,60.78 15.88,58.88 IC5.5
LED_ZAV_GREEN_R
  Top 0.406: LED2.2A 4.82,64.15 R38.1
LED_ZAV_RED
  Top 0.406: R39.2 17.78,59.51 17.14,58.88 IC5.4
LED_ZAV_RED_R
  Top 0.406: R39.1 17.78,65.56 16.83,66.51 4.13,66.51 2.76,65.14 LED2.1A
PROG_MISO
  Top 0.305: IC2.16 68.32,35.77 66.04,33.49 U1.2
PROG_MOSI
  Top 0.305: IC2.15 67.85,36.57 67.31,36.03 U1.1
PROG_SCK
  Top 0.305: U1.3 66.04,30.95 69.37,34.28 IC2.17
RS_RX
  Top 0.305: IC2.30 84.7,39.77 86.04,41.11 95.89,41.11 100.33,36.66 100.33,27.46 107.69,20.1 IC1.1
RS_TE
  Top 0.305: IC1.3 IC1.2 108.9,17.62 109.22,17.93 109.22,19.52 100.97,27.77 100.97,36.98 99.69,38.25 99.69,39.2 100.01,39.52 100.01,40.16 99.06,41.11 97.79,41.11 96.52,42.38 85.41,42.38 84.4,41.37 IC2.32
RS_TX  (via drill 0.3)
  Top 0.305: IC2.31 84.55,40.57 85.72,41.74 96.2,41.74 98.11,39.84 v98.74,39.84 | IC1.4 106.68,15.08 106.05,15.71 106.05,20.79 99.69,27.14 99.69,36.35 98.74,37.3 v97.16,37.3
  Bottom 0.305: v98.74,39.84 98.74,38.89 v97.16,37.3
SYS_12V
  Top 1.2: J1.A4 154.7,81.51 152.4,79.21 146.05,79.21 143.51,76.67 129.54,76.67 127,74.13 SJ1.2
XTAL1
  Top 0.305: IC2.7 76.74,50.67 Q1.1
  Bottom 0.305: C4.1 78.74,52.67 Q1.1
XTAL2
  Top 0.305: IC2.8 75.94,50.39 Q1.2
  Bottom 0.305: C5.1 73.66,52.67 Q1.2
ZAV_A
  Top 0.406: T1.5 T1.6 T1.7 T1.8 136.96,47.66 136.07,48.55 R40.1
  Top 0.7: J1.A12 152.16,58.89 147.64,58.89 146.69,57.94 146.69,50.63 143.71,47.66 T1.5
ZAV_B
  Top 0.406: T2.8 T2.7 T2.6 T2.5 136.96,52.34 136.07,51.45 R40.2
  Top 0.7: J1.C12 146.69,61.43 144.15,58.89 144.15,53.81 142.67,52.34 T2.8

### Text on the board
Top: TOP | V-00491-03 / LIC_rack_OV-03 / Lukas Novak / 30.07.2015
Bottom: BOT